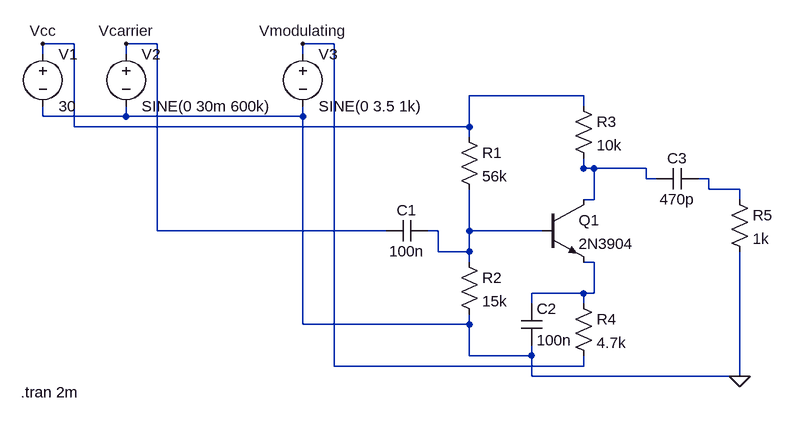
[diagram p0: schematic AM-modulator-bjt.asc]
AM-modulator-bjt.asc, the LTspice schematic file:
Version 4.1
SHEET 1 1104 748
WIRE 720 480 720 496
WIRE 624 432 624 448
WIRE 1040 336 1040 352
WIRE -32 112 -32 128
WIRE 96 112 96 128
WIRE 368 112 368 128
WIRE 720 496 624 496
WIRE 624 496 624 448
WIRE 720 496 720 528
WIRE 720 528 1040 528
WIRE 1040 528 1040 352
WIRE 624 448 368 448
WIRE 368 448 368 128
WIRE 368 128 96 128
WIRE 96 128 -32 128
FLAG 1040 528 0
WIRE 912 224 896 224
WIRE 800 256 816 256
WIRE 800 192 800 208
WIRE 896 224 896 208
WIRE 896 208 800 208
WIRE 800 208 816 208
WIRE 816 208 816 256
WIRE 976 224 992 224
WIRE 1040 256 1040 240
WIRE 992 224 992 240
WIRE 992 240 1040 240
WIRE 560 304 576 304
WIRE 736 304 720 304
WIRE 624 240 624 256
WIRE 624 352 624 336
WIRE 576 304 576 336
WIRE 576 336 624 336
WIRE 624 336 624 256
WIRE 624 336 624 304
WIRE 624 304 720 304
WIRE 720 416 720 400
WIRE 800 352 816 352
WIRE 800 416 800 400
WIRE 720 400 800 400
WIRE 800 400 816 400
WIRE 816 400 816 352
WIRE 496 304 480 304
WIRE 96 32 96 16
WIRE 480 304 144 304
WIRE 144 304 144 16
WIRE 144 16 96 16
FLAG 96 16 Vcarrier
WIRE 624 160 624 144
WIRE 800 112 800 96
WIRE -32 32 -32 16
WIRE 624 144 624 96
WIRE 624 96 800 96
WIRE 624 144 16 144
WIRE 16 144 16 16
WIRE 16 16 -32 16
FLAG -32 16 Vcc
WIRE 800 496 800 512
WIRE 368 32 368 16
WIRE 800 512 416 512
WIRE 416 512 416 16
WIRE 416 16 368 16
FLAG 368 16 Vmodulating
SYMBOL voltage -32 16 R0
WINDOW 123 0 0 Left 0
WINDOW 39 0 0 Left 0
SYMATTR InstName V1
SYMATTR Value 30
SYMBOL voltage 96 16 R0
WINDOW 123 0 0 Left 0
WINDOW 39 0 0 Left 0
SYMATTR InstName V2
SYMATTR Value SINE(0 30m 600k)
SYMBOL voltage 368 16 R0
WINDOW 123 0 0 Left 0
WINDOW 39 0 0 Left 0
SYMATTR InstName V3
SYMATTR Value SINE(0 3.5 1k)
SYMBOL res 608 144 R0
SYMATTR InstName R1
SYMATTR Value 56k
SYMBOL res 608 336 R0
SYMATTR InstName R2
SYMATTR Value 15k
SYMBOL cap 560 288 R90
WINDOW 0 0 32 VBottom 2
WINDOW 3 32 32 VTop 2
SYMATTR InstName C1
SYMATTR Value 100n
SYMBOL npn 736 256 R0
SYMATTR InstName Q1
SYMATTR Value 2N3904
SYMBOL res 784 96 R0
SYMATTR InstName R3
SYMATTR Value 10k
SYMBOL res 784 400 R0
SYMATTR InstName R4
SYMATTR Value 4.7k
SYMBOL cap 704 416 R0
SYMATTR InstName C2
SYMATTR Value 100n
SYMBOL cap 976 208 R90
WINDOW 0 0 32 VBottom 2
WINDOW 3 32 32 VTop 2
SYMATTR InstName C3
SYMATTR Value 470p
SYMBOL res 1024 240 R0
SYMATTR InstName R5
SYMATTR Value 1k
TEXT -66 552 Left 2 !.tran 2m

The netlist it stands for:
* AM-modulator-bjt.asc
V1 Vcc 0 30
V2 Vcarrier 0 SINE(0 30m 600k)
V3 Vmodulating 0 SINE(0 3.5 1k)
R1 Vcc N003 56k
R2 N003 0 15k
C1 N003 Vcarrier 100n
Q1 N001 N003 N004 0 2N3904
R3 Vcc N001 10k
R4 N004 Vmodulating 4.7k
C2 N004 0 100n
C3 N002 N001 470p
R5 N002 0 1k
.model NPN NPN
.model PNP PNP
.lib standard.bjt
.tran 2m
.backanno
.end